# Altium schematic sheet AVR最小系统板.SchDoc
size A4
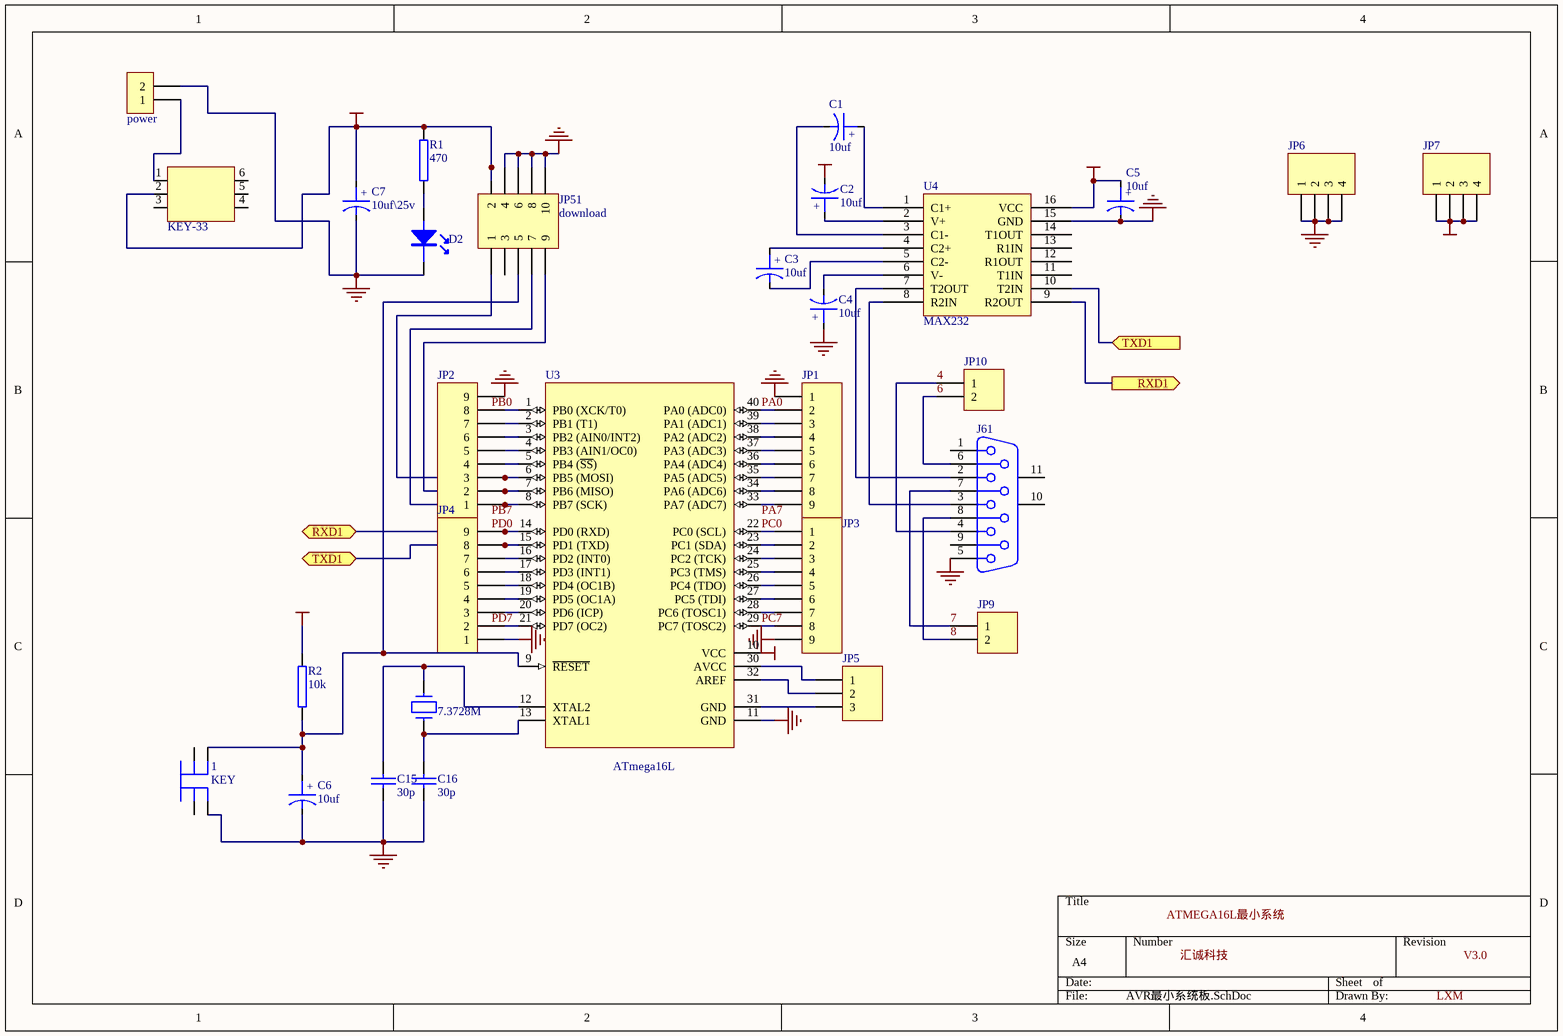
[diagram p0: AVR最小系统板.SchDoc]

## Parts
1  KEY  [KEY-1]
11  power  [power1]
C1  10uf  [cap2]
C2  10uf  [cap2]
C3  10uf  [cap2]
C4  10uf  [cap2]
C5  10uf  [cap2]
C6  10uf  [cap2]
C7  10uf\25v  [cap2]
C15  30p  [RAD0.3]
C16  30p  [RAD0.3]
D2  LED  [LED]  (value not drawn)
J61  D Connector 9  [DSUB1.385-2H9]  (value not drawn)
JP1  (no value)  [HDR1X9]
JP2  (no value)  [HDR1X9]
JP3  (no value)  [HDR1X9]
JP4  (no value)  [HDR1X9]
JP5  (no value)  [HDR1X3]
JP6  (no value)  [HDR1X4]
JP7  (no value)  [HDR1X4]
JP9  (no value)  [HDR1X2]
JP10  Header 3  [HDR1X2]  (value not drawn)
JP51  download  [HDR2X5]
R1  470  [AXIAL0.4]
R2  10k  [AXIAL0.4]
RT  KEY-33  [KEY-2]
U3  ATmega16L  [40P6]
U4  MAX232  [DIP16]
Y1  7.3728M  [CRYSTAL]

## Ports
RXD1, RXD1 (out), TXD1, TXD1 (in)

## Nets
GND: 1.1 11.2 C4.1 C5.2 C6.2 C7.2 C15.2 C16.2 D2.2(K) J61.5 JP1.1 JP2.9 JP3.9 JP4.1 JP6.1 JP6.2 JP6.3 JP6.4 JP51.4 JP51.6 JP51.8 JP51.10 U3.11(GND) U4.15(GND)
VCC: C2.2 C5.1 C7.1 JP7.1 JP7.2 JP7.3 JP7.4 JP51.2 R1.1 R2.1 RT.2 U3.10(VCC) U4.16(VCC)
4: J61.4 JP10.1
6: J61.6 JP10.2
7: J61.7 JP9.1
8: J61.8 JP9.2
PA0: JP1.2 U3.40(PA0_(ADC0))
PC0: JP3.1 U3.22(PC0_(SCL))
PC7: JP3.8 U3.29(PC7_(TOSC2))
PD0: JP4.9 U3.14(PD0_(RXD)) U4.9(R2OUT) ; port RXD1
TXD1: JP4.8 U3.15(PD1_(TXD)) U4.10(T2IN) ; port TXD1
Net1_3: 1.3 C6.1 JP51.5 R2.2 U3.9(~{RESET})
Net11_1: 11.1 RT.1
NetC1_1: C1.1 U4.1(C1+)
NetC1_2: C1.2 U4.3(C1-)
NetC2_1: C2.1 U4.2(V+)
NetC3_1: C3.1 U4.4(C2+)
NetC3_2: C3.2 U4.5(C2-)
NetC4_2: C4.2 U4.6(V-)
NetC15_1: C15.1 U3.12(XTAL2) Y1.1
NetC16_1: C16.1 U3.13(XTAL1) Y1.2
NetD2_1: D2.1(A) R1.2
NetJ61_2: J61.2 U4.7(T2OUT)
NetJ61_3: J61.3 U4.8(R2IN)
NetJP1_3: JP1.3 U3.39(PA1_(ADC1))
NetJP1_4: JP1.4 U3.38(PA2_(ADC2))
NetJP1_5: JP1.5 U3.37(PA3_(ADC3))
NetJP1_6: JP1.6 U3.36(PA4_(ADC4))
NetJP1_7: JP1.7 U3.35(PA5_(ADC5))
NetJP1_8: JP1.8 U3.34(PA6_(ADC6))
NetJP1_9: JP1.9 U3.33(PA7_(ADC7))
NetJP2_1: JP2.1 JP51.7 U3.8(PB7_(SCK))
NetJP2_2: JP2.2 JP51.9 U3.7(PB6_(MISO))
NetJP2_3: JP2.3 JP51.1 U3.6(PB5_(MOSI))
NetJP2_4: JP2.4 U3.5(PB4_(~{SS}))
NetJP2_5: JP2.5 U3.4(PB3_(AIN1/OC0))
NetJP2_6: JP2.6 U3.3(PB2_(AIN0/INT2))
NetJP2_7: JP2.7 U3.2(PB1_(T1))
NetJP2_8: JP2.8 U3.1(PB0_(XCK/T0))
NetJP3_2: JP3.2 U3.23(PC1_(SDA))
NetJP3_3: JP3.3 U3.24(PC2_(TCK))
NetJP3_4: JP3.4 U3.25(PC3_(TMS))
NetJP3_5: JP3.5 U3.26(PC4_(TDO))
NetJP3_6: JP3.6 U3.27(PC5_(TDI))
NetJP3_7: JP3.7 U3.28(PC6_(TOSC1))
NetJP4_2: JP4.2 U3.21(PD7_(OC2))
NetJP4_3: JP4.3 U3.20(PD6_(ICP))
NetJP4_4: JP4.4 U3.19(PD5_(OC1A))
NetJP4_5: JP4.5 U3.18(PD4_(OC1B))
NetJP4_6: JP4.6 U3.17(PD3_(INT1))
NetJP4_7: JP4.7 U3.16(PD2_(INT0))
NetJP5_1: JP5.1 U3.30(AVCC)
NetJP5_2: JP5.2 U3.32(AREF)
NetJP5_3: JP5.3 U3.31(GND)

Not connected (* = marked no-connect by the designer): 1 0 2; J61 1 9 10(MH1) 11(MH2); JP51 3; RT 3 4 5 6; U4 11(T1IN) 12(R1OUT) 13(R1IN) 14(T1OUT)

## Notes on the sheet
- Labels drawn without touching a wire or pin: ATMEGA16L最小系统, LXM, PA7, PB0, PB7, PD7, V3.0, 汇诚科技
- (in symbol CAPACITOR POL) +

## Library data of the parts
C1-C7 = CAPACITOR POL: Capacitor
C15 C16 = CAP: Capacitor
J61 = D Connector 9: Receptacle Assembly, 9 Position, Right Angle; Package Information: Latest Revision: O; Positions: 9; Published: 15-Jun-2001; Revision: 17-Jul-2002: Re-released for DXP Platform.; Datasheet: (1-Sep-1999); Package Reference: 788750; Publisher: Altium Limited; Orientation: Right Angle; Gender: Receptacle
JP1-JP4 = Header 9: Header, 9-Pin; Revision: 17-Jul-2002: Re-released for DXP Platform.; Publisher: Altium Limited
JP5 = Header 3: Header, 3-Pin; Revision: 17-Jul-2002: Re-released for DXP Platform.; Publisher: Altium Limited
JP6 JP7 = Header 4: Header, 4-Pin; Revision: 17-Jul-2002: Re-released for DXP Platform.; Publisher: Altium Limited
JP9 JP10 = Header 2: Header, 2-Pin; Revision: 17-Jul-2002: Re-released for DXP Platform.; Publisher: Altium Limited
JP51 = Header 5X2: Header, 5-Pin, Dual row; Revision: 17-Jul-2002: Re-released for DXP Platform.; Publisher: Altium Limited
R1 R2 = RES2
U3 = ATmega16L-8PI: 8-Bit AVR Microcontroller with 16K Bytes of In-System Programmable Flash Memory; Package Information: Latest Revision: Dec-1999; Published: 17-Sep-2003; Datasheet: Latest Revision: 2466E-AVR-10/02; Package Reference: 40P6; Publisher: Altium Limited
Y1 = CRYSTAL